# Altium schematic sheet DRV8300_CONTROLS.SchDoc
size B
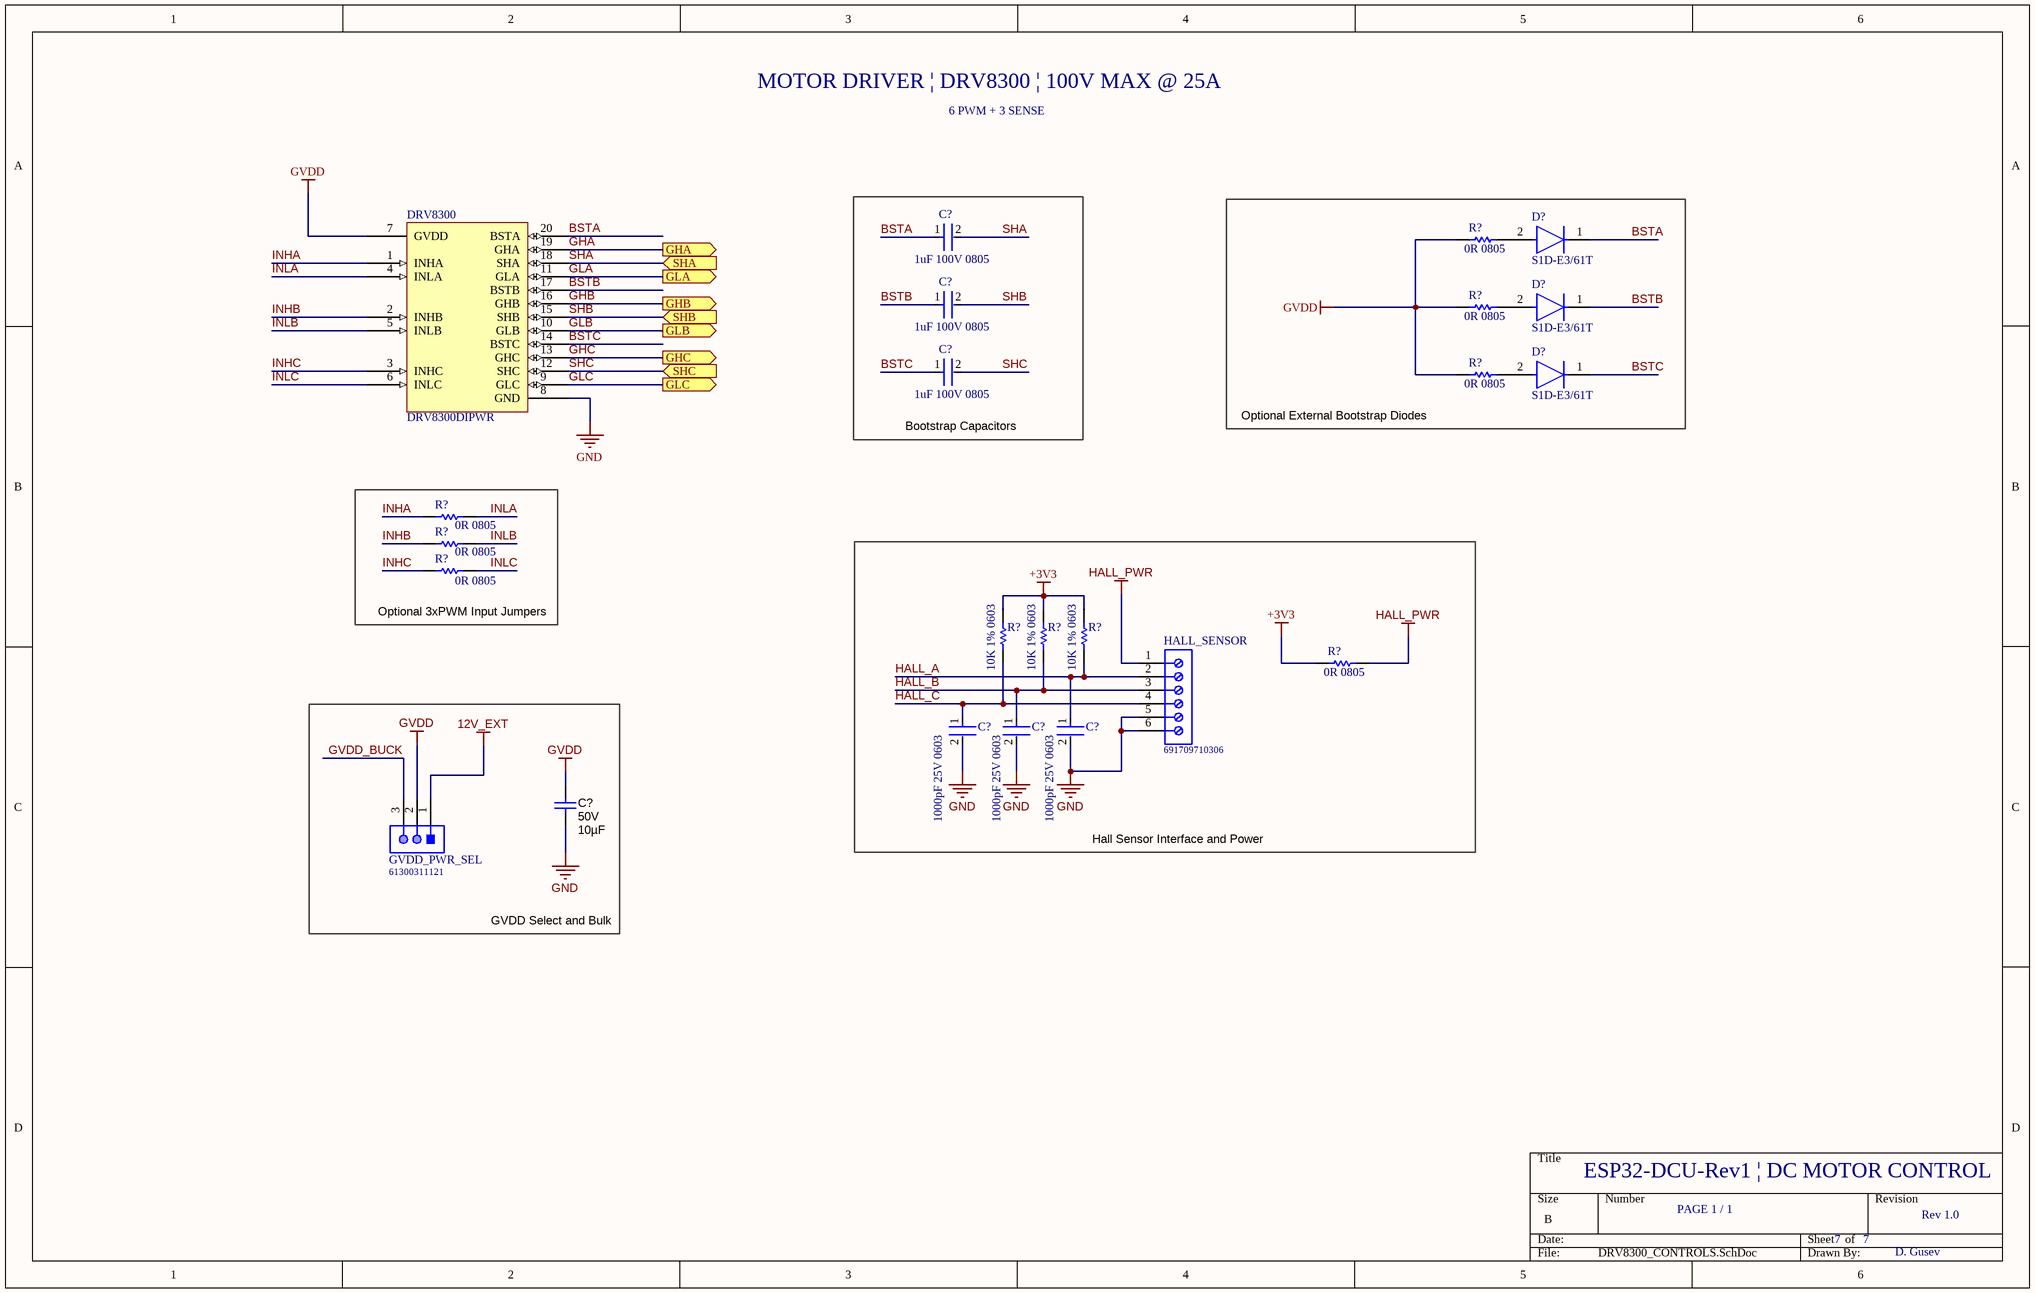
[diagram p0: DRV8300_CONTROLS.SchDoc]

## Parts
(Parts that share a designator on the sheet are numbered #1, #2 ... from top to bottom, then left to right.)
C?#1  1uF 100V 0805  [FP-C2012-125-0_2-IPC_A]
C?#2  1uF 100V 0805  [FP-C2012-125-0_2-IPC_A]
C?#3  1uF 100V 0805  [FP-C2012-125-0_2-IPC_A]
C?#4  1000pF 25V 0603  [FP-CC0201-BA-MFG]
C?#5  1000pF 25V 0603  [FP-CC0201-BA-MFG]
C?#6  1000pF 25V 0603  [FP-CC0201-BA-MFG]
C?#7  VDC_V: 50V  ValueDisplayed: 10µF  [1210_270L]  (hidden comment: CL32B106KBJNNWE)
D?#1  S1D-E3/61T  [FP-95400-MFG]
D?#2  S1D-E3/61T  [FP-95400-MFG]
D?#3  S1D-E3/61T  [FP-95400-MFG]
DRV8300  DRV8300DIPWR  [TSSOP_0DIPWR_TEX]
GVDD_PWR_SEL  61300311121  [61300311121]
HALL_SENSOR  691709710306  [691709710306]
R?#1  0R 0805  [RESC2013X60X35ML10T20]
R?#2  0R 0805  [RESC2013X60X35ML10T20]
R?#3  0R 0805  [RESC2013X60X35ML10T20]
R?#4  0R 0805  [RESC2013X60X35ML10T20]
R?#5  0R 0805  [RESC2013X60X35ML10T20]
R?#6  0R 0805  [RESC2013X60X35ML10T20]
R?#7  10K 1% 0603  [RESC2013X70X40ML20T20]
R?#8  10K 1% 0603  [RESC2013X70X40ML20T20]
R?#9  10K 1% 0603  [RESC2013X70X40ML20T20]
R?#10  0R 0805  [RESC2013X60X35ML10T20]

## Blocks framed on the sheet
Bootstrap Capacitors: C?#1-C?#3
Optional External Bootstrap Diodes: D?#1-D?#3 R?#1-R?#3
Optional 3xPWM Input Jumpers: R?#4-R?#6
Hall Sensor Interface and Power: C?#4-C?#6 HALL_SENSOR R?#7-R?#10
GVDD Select and Bulk: C?#7 GVDD_PWR_SEL

## Ports
GHA (out), GHB (out), GHC (out), GLA (out), GLB (out), GLC (out), SHA (in), SHB (in), SHC (in)

## Nets
12V_EXT: GVDD_PWR_SEL.1
+3V3: R?#7.1 R?#8.1 R?#9.1 R?#10.1
GND: C?#4.2 C?#5.2 C?#6.2 C?#7.2 DRV8300.8(GND) HALL_SENSOR.5 HALL_SENSOR.6
GVDD: C?#7.1 DRV8300.7(GVDD) GVDD_PWR_SEL.2 R?#1.1 R?#2.1 R?#3.1
HALL_PWR: HALL_SENSOR.1 R?#10.2
BSTA: C?#1.1 D?#1.1(C) DRV8300.20(BSTA)
BSTB: C?#2.1 D?#2.1(C) DRV8300.17(BSTB)
BSTC: C?#3.1 D?#3.1(C) DRV8300.14(BSTC)
GHA: DRV8300.19(GHA) ; port GHA
GHB: DRV8300.16(GHB) ; port GHB
GHC: DRV8300.13(GHC) ; port GHC
GLA: DRV8300.11(GLA) ; port GLA
GLB: DRV8300.10(GLB) ; port GLB
GLC: DRV8300.9(GLC) ; port GLC
GVDD_BUCK: GVDD_PWR_SEL.3
HALL_A: C?#6.1 HALL_SENSOR.2 R?#9.2
HALL_B: C?#5.1 HALL_SENSOR.3 R?#8.2
HALL_C: C?#4.1 HALL_SENSOR.4 R?#7.2
INHA: DRV8300.1(INHA) R?#4.1
INHB: DRV8300.2(INHB) R?#5.1
INHC: DRV8300.3(INHC) R?#6.1
INLA: DRV8300.4(INLA) R?#4.2
INLB: DRV8300.5(INLB) R?#5.2
INLC: DRV8300.6(INLC) R?#6.2
SHA: C?#1.2 DRV8300.18(SHA) ; port SHA
SHB: C?#2.2 DRV8300.15(SHB) ; port SHB
SHC: C?#3.2 DRV8300.12(SHC) ; port SHC
NetD?#1_2: D?#1.2(A) R?#1.2
NetD?#2_2: D?#2.2(A) R?#2.2
NetD?#3_2: D?#3.2(A) R?#3.2

## Notes on the sheet
- MOTOR DRIVER | DRV8300 | 100V MAX @ 25A
- 6 PWM + 3 SENSE
- ESP32-DCU-Rev1 | DC MOTOR CONTROL
- PAGE 1 / 1
- 7
- Rev 1.0
- D. Gusev

## Library data of the parts
C?#1-C?#3 = CMP-2000-05454-2: Multilayer Ceramic Capacitors 1μF ±10% 100V X7S SMD 0805; Case Code (Metric): 2012; Capacitance: 1uF; Width: 1.25mm; Mount: Surface Mount; Package Quantity: 1; RoHS Compliant: Yes; Case Code (Imperial): 0805; REACH SVHC: No SVHC; Resistor Type: Ceramic; Depth: 1.25mm; Dielectric: X7S; Thickness: 0.053inch; Case/Package: 0805; Lead Free: Lead Free; Length: 2mm; Series: C; Voltage Rating (DC): 100V; Voltage: 100V; Height: 1.25mm; Min Operating Temperature: -55°C; Termination: SMD/SMT; Weight: 0.000194oz; Max Operating Temperature: 125°C; Number of Pins: 2; Tolerance: 10%; Packaging: Tape and Reel; Voltage Rating: 100V
C?#4-C?#6 = CMP-03422-000456-1: CAP CER 1000PF 25V X7R 0201; Manufacturer Part Number: CC0201KRX7R8BB102; Manufacturer: Yageo; Description: CC0201 1.0 nF X7R 10.00% 25 V; Temperature Coefficient: 15%; Tolerance: 0.1; Capacitance: 1.0 nF; Value: 1.0 nF; Material: Ceramic; Footprint Url: http://www.yageo.com/exep/pages/download/literatures/UPY-C_GEN_24.pdf; Digikey Description: CAP CER 1000PF 25V X7R 0201; Voltage Rating: 25 V; ComponentLink2URL: http://www.yageo.com/documents/recent/UPY-GPHC_X5R_4V-to-50V_25.pdf; Lead Free: Yes; Temperature: -55°C to +85°C; Package: CC0201-BA; Automotive: No; Device Class L1: Passive Components; ComponentLink2Description: Datasheet; Octopart: https://octopart.com/cc0201krx7r8bb102-yageo-9292631; Temperature Range High: +85°C; Device Class L3: Ceramic Capacitors; Temperature Range Low: -55°C; Category: Cap; Device Class L2: Capacitors; Ipc Land Pattern Name: CAPC6030X30; Height: 0.33mm; Temperature Characteristic: X7R; RoHS: TRUE; Mouser Description: Multilayer Ceramic Capacitors MLCC - SMD/SMT 1.0nF 25V X7R 10%
C?#7 = CMP-0079201-1: CAP, CERM, 10 µF, 50 V,+/- 10%, X7R, 1210; Manufacturer: Samsung Electro-Mechanics; TaMin_C: -55°C; ESR_ohm: 5m; Polarized: N; SizeAreaWB_mm2: 14.7; Value1: 0.005 ohm; U/M: EA; Value: 10uF; TaMax_C: 125°C; SizeZ_mm: 2.7; SizeX_mm: 3.2; SizeY_mm: 2.5; Cap_Case: 1210; SizeArea_mm2: 8; AEC Category: Q200; ComponentLink1URL: http://www.samsungsem.com/kr/support/product-search/mlcc/__icsFiles/afieldfile/2016/08/18/S_CL32B106KBJNNWE.pdf; TempCo: X7R; RoHS: Y; MountType: SMT; Supplier 1: Digi-Key; PackageReference: 1210; Tolerance_%: 10%; Value2: 50V; CompType: Capacitor; PartNumber: CL32B106KBJNNWE; AEC Qualified: N; Cap_F: 10µF; ComponentLink1Description: Datasheet link; AEC Grade: N/A; Supplier Part Number 1: 1276-3388-1-ND; Technology: Ceramic
D?#1-D?#3 = CMP-02540-000033-1: DIODE GEN PURP 200V 1A DO214AC; Manufacturer: Vishay; Max Junction Temp: +150°C; Peak Reverse Current: 1uA; Standoff Height: 0mm; Max Surge Forward Current: 40A; Value: 12pF; Description: Diode Standard 200V 1A Surface Mount DO-214AC (SMA); Lead Free: Yes; Device Class L3: Rectifier Diodes; Package: 95400; Category: Diode; ComponentLink2URL: http://www.vishay.com/docs/88711/s1.pdf; Temperature: -55°C to +150°C; Mouser Description: S1B Series 1 A 200 V Surface Mount Glass Passivated Rectifier - DO-214AC; Digikey Description: DIODE GEN PURP 200V 1A DO214AC; Automotive: No; Forward Current: 1A; Device Class L1: Discrete Semiconductors; Max Repetitive Reverse Voltage: 200V; Manufacturer Part Number: S1D-E3/61T; Temperature Range High: +150°C; Octopart: https://octopart.com/s1d-e3%2F61t-vishay-39552129; ComponentLink2Description: Datasheet; Device Class L2: Diodes; RoHS: TRUE; Temperature Range Low: -55°C; Footprint Url: http://www.vishay.com/docs/95400/sma.pdf; Height: 2.29mm; Reverse Voltage: 200V; Capacitance: 12pF
DRV8300 = DRV8300DIPWR: No Description Available; Mfr_Name: Texas Instruments; Copyright: Copyright (C) 2022 Ultra Librarian. All rights reserved.; Manufacturer_Part_Number: DRV8300DIPWR; Digi-Key_Part_Number_1: 296-DRV8300DIPWRCT-ND; Digi-Key_Part_Number_2: 296-DRV8300DIPWRDKR-ND; Digi-Key_Part_Number_3: 296-DRV8300DIPWRTR-ND; RefDes: RefDes; Type: DEV
GVDD_PWR_SEL = CMP-1502-01062-1: THT Vertical Pin Header WR-PHD, Pitch 2.54 mm, Single Row, 3 pins; Manufacturer: Wurth Elektronik; Withstanding Voltage: 500VAC; Working Voltage: 250VAC; Rated Current: 3A; Pitch: 2.54mm; Pin Number: 3; Gender: Male; Contact Resistance: 20mOhm; Package Reference: 61300311121; Manufacturer URL: http://www.we-online.de; Datasheet URL: https://katalog.we-online.de/em/datasheet/6130xx11121.pdf; Operating Temperature: -40to105degC; Part Number: 61300311121; Orientation: Vertical; Packaging: Bag; Row Number: Single; Mounting Technology: THT; Publisher: WurthElektronik
HALL_SENSOR = CMP-1502-03339-1: Serie 7097 - 5.00 mm Horizontal Entry SMT with Pressure Clamp WR-TBL, 6 pin; Manufacturer: Wurth Elektronik; Pin Number: 6; Pitch: 5.00mm; Mounting Technology: SMT; Package Reference: 691709710306; Part Number: 691709710306; Publisher: WurthElektronik; Manufacturer URL: http://www.we-online.de; Operating Temperature: -45to130degC; Datasheet URL: http://katalog.we-online.de/em/datasheet/6917097103xx.pdf; Packaging: TapeandReelwithCap
R?#1-R?#6 R?#10 = CMP-2100-03673-1: Chip Resistor, 0 Ohm, Jumper, +/- 5%, 0.125 W, -55 to 155 degC, 0805 (2012 Metric), RoHS, Tape and Reel; Manufacturer: Yageo; Power Rating: 125mW; Resistance: 0mOhm; Voltage Rating (DC): 150V; Temperature Coefficient: 200ppm/degreesC; Height: 0.5mm; Depth: 1.25mm; Case Code (Imperial): 0805; Lead Free: LeadFree; Military Standard: Not; Package Description: 2-Pin Surface Mounted Device, Body 2 x 1.25 mm; Case Code (Metric): 2012; Composition: ThickFilm; Voltage Rating: 150V; Manufacturer URL: http://www.yageo.com/; Packaging: TapeandReel; Package Reference: 0805; REACH SVHC: Unknown; Tolerance: 5%; Case/Package: 0805; Max Operating Temperature: 155degC; Number of Pins: 2; Min Operating Temperature: -55degC; RoHSCompliant: true; Length: 2mm; Datasheet URL: http://www.yageo.com/NewPortal/yageodocoutput?fileName=/pdf/R-Chip/PYu-RC_Group_51_RoHS_L_5.pdf; Termination: SMD/SMT; Radiation Hardening: No; Width: 1.25mm; Contact Plating: Tin; Datasheet Version: Rev. 5, 10/2016
R?#7-R?#9 = CMP-2001-04376-1: Manufacturer: Panasonic; Part Number: ERJ-6ENF1002V